# Altium project PCB_Project1.PrjPCB
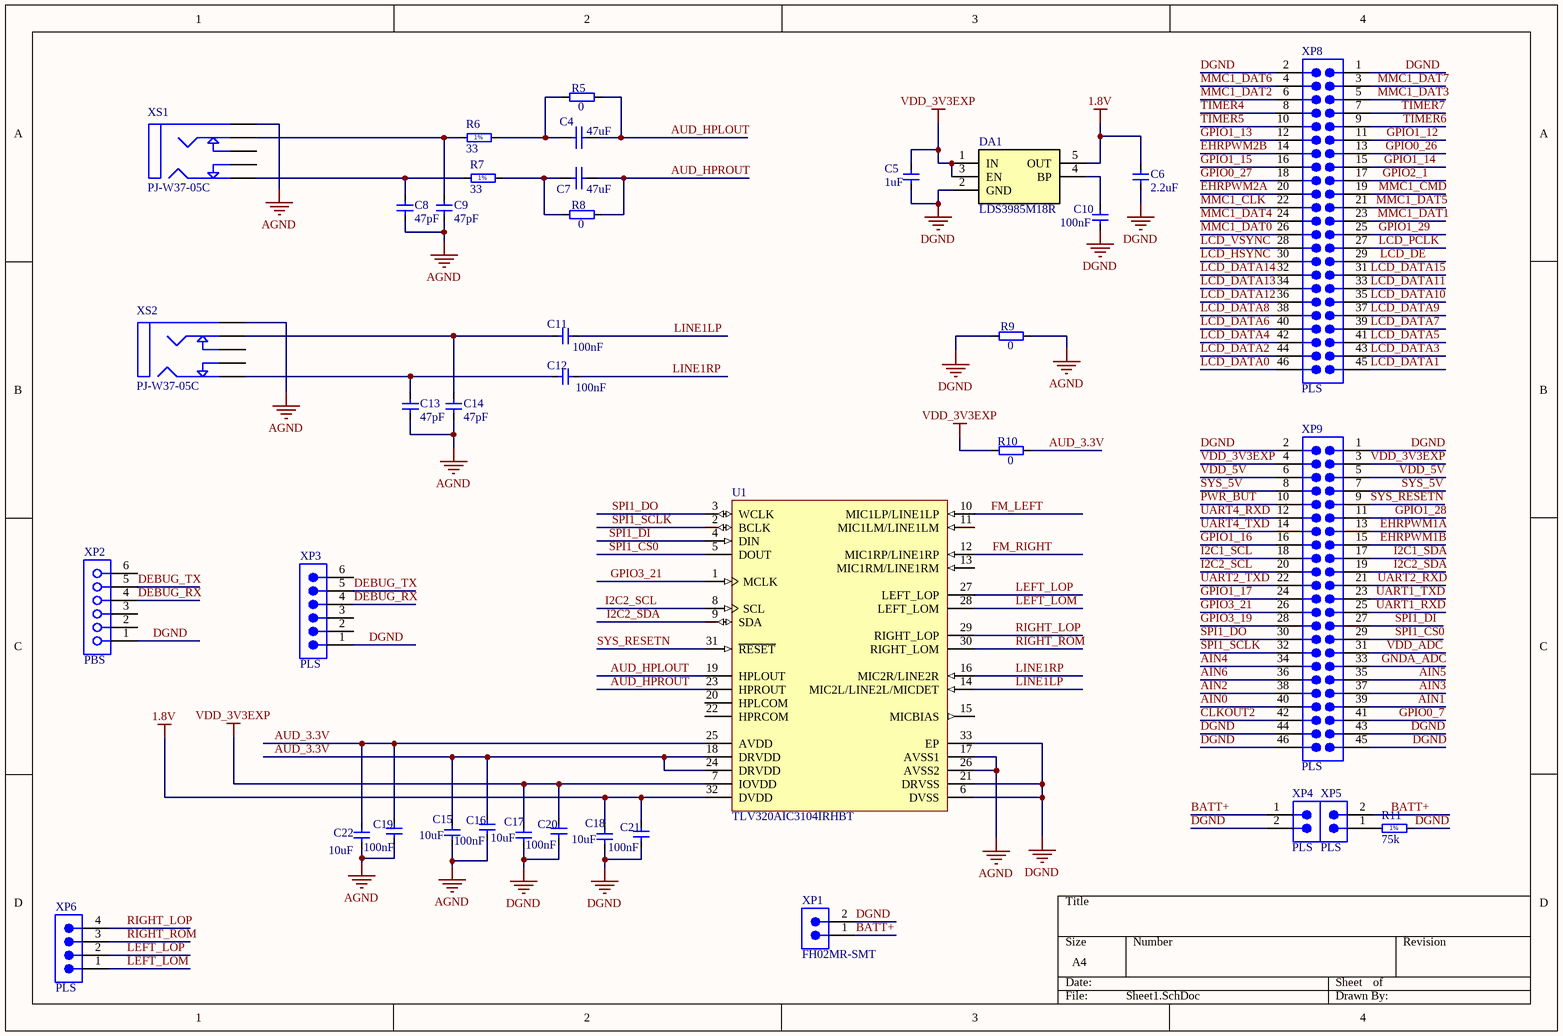
[diagram p0: Sheet1.SchDoc]
4 sheets, 98 parts. Net scope: global (net labels, ports and power ports of the same name join across sheets).
Board file: PCB1.PcbDoc
Sheets:
  Sheet1.SchDoc
  Sheet2.SchDoc
  GPS.SchDoc
  Radio.SchDoc

## Sheet Sheet1.SchDoc
size A4

### Parts
C4  47uF  [CAPC2012X140N]
C5  1uF  [CAP0603R]
C6  2.2uF  [CAP0603R]
C7  47uF  [CAPC2012X140N]
C8  47pF  [CAP0603R]
C9  47pF  [CAP0603R]
C10  100nF  [CAP0603R]
C11  100nF  [CAP0603R]
C12  100nF  [CAP0603R]
C13  47pF  [CAP0603R]
C14  47pF  [CAP0603R]
C15  10uF  [CAP0603R]
C16  100nF  [CAP0603R]
C17  10uF  [CAP0603R]
C18  10uF  [CAP0603R]
C19  100nF  [CAP0603R]
C20  100nF  [CAP0603R]
C21  100nF  [CAP0603R]
C22  10uF  [CAP0603R]
DA1  LDS3985M18R  [SOT23-5]
R5  0  [RESC1608X55N]
R6  33  [RES0603R]
R7  33  [RES0603R]
R8  0  [RESC1608X55N]
R9  0  [RESC1608X55N]
R10  0  [RESC1608X55N]
R11  75k  [RES0603R]
U1  TLV320AIC3104IRHBT  [RHB32-3450X3450TP]
XP1  FH02MR-SMT  [FH02MR-SMT]
XP2  PBS  [PBS-06]
XP3  PLS  [PLS-06]
XP4  PLS  [PLS-02]
XP5  PLS  [PLS-02]
XP6  PLS  [PLS-04]
XP8  PLS  [PLD-46]
XP9  PLS  [PLD-46]
XS1  PJ-W37-05C  [PJ-W37-05C]
XS2  PJ-W37-05C  [PJ-W37-05C]

### Nets
1.8V: C6.2 C18.2 C21.1 DA1.5(OUT) U1.32(DVDD)
AGND: C8.2 C9.2 C13.2 C14.2 C15.1 C16.2 C19.2 C22.1 R9.2 U1.17(AVSS1) U1.26(AVSS2) XS1.1 XS2.1
DGND: C5.2 C6.1 C10.1 C17.1 C18.1 C20.2 C21.2 DA1.2(GND) R9.1 R11.2 U1.6(DVSS) U1.21(DRVSS) U1.33(EP) XP1.2 XP2.1 XP3.1 XP4.2 XP8.1 XP8.2 XP9.1 XP9.2 XP9.43 XP9.44 XP9.45 XP9.46
VDD_3V3EXP: C5.1 C17.2 C20.1 DA1.1(IN) DA1.3(EN) R10.1 U1.7(IOVDD) XP9.3 XP9.4
AIN0: XP9.40
AIN1: XP9.39
AIN2: XP9.38
AIN3: XP9.37
AIN4: XP9.34
AIN5: XP9.35
AIN6: XP9.36
AUD_3.3V: C15.2 C16.1 C19.1 C22.2 R10.2 U1.18(DRVDD) U1.24(DRVDD) U1.25(AVDD)
AUD_HPLOUT: C4.2 R5.2 U1.19(HPLOUT)
AUD_HPROUT: C7.2 R8.2 U1.23(HPROUT)
BATT+: XP1.1 XP4.1 XP5.2
CLKOUT2: XP9.42
DEBUG_RX: XP2.4 XP3.4
DEBUG_TX: XP2.5 XP3.5
EHRPWM1A: XP9.13
EHRPWM1B: XP9.15
EHRPWM2A: XP8.20
EHRPWM2B: XP8.14
FM_LEFT: U1.10(MIC1LP/LINE1LP)
FM_RIGHT: U1.12(MIC1RP/LINE1RP)
GNDA_ADC: XP9.33
GPIO0_7: XP9.41
GPIO0_26: XP8.13
GPIO0_27: XP8.18
GPIO1_12: XP8.11
GPIO1_13: XP8.12
GPIO1_14: XP8.15
GPIO1_15: XP8.16
GPIO1_16: XP9.16
GPIO1_17: XP9.24
GPIO1_28: XP9.11
GPIO1_29: XP8.25
GPIO2_1: XP8.17
GPIO3_19: XP9.28
GPIO3_21: U1.1(MCLK) XP9.26
I2C1_SCL: XP9.18
I2C1_SDA: XP9.17
I2C2_SCL: U1.8(SCL) XP9.20
I2C2_SDA: U1.9(SDA) XP9.19
LCD_DATA0: XP8.46
LCD_DATA1: XP8.45
LCD_DATA2: XP8.44
LCD_DATA3: XP8.43
LCD_DATA4: XP8.42
LCD_DATA5: XP8.41
LCD_DATA6: XP8.40
LCD_DATA7: XP8.39
LCD_DATA8: XP8.38
LCD_DATA9: XP8.37
LCD_DATA10: XP8.35
LCD_DATA11: XP8.33
LCD_DATA12: XP8.36
LCD_DATA13: XP8.34
LCD_DATA14: XP8.32
LCD_DATA15: XP8.31
LCD_DE: XP8.29
LCD_HSYNC: XP8.30
LCD_PCLK: XP8.27
LCD_VSYNC: XP8.28
LEFT_LOM: U1.28(LEFT_LOM) XP6.1
LEFT_LOP: U1.27(LEFT_LOP) XP6.2
LINE1LP: C11.2 U1.14(MIC2L/LINE2L/MICDET)
LINE1RP: C12.2 U1.16(MIC2R/LINE2R)
MMC1_CLK: XP8.22
MMC1_CMD: XP8.19
MMC1_DAT0: XP8.26
MMC1_DAT1: XP8.23
MMC1_DAT2: XP8.6
MMC1_DAT3: XP8.5
MMC1_DAT4: XP8.24
MMC1_DAT5: XP8.21
MMC1_DAT6: XP8.4
MMC1_DAT7: XP8.3
PWR_BUT: XP9.10
RIGHT_LOP: U1.29(RIGHT_LOP) XP6.4
RIGHT_ROM: U1.30(RIGHT_LOM) XP6.3
SPI1_CS0: U1.5(DOUT) XP9.29
SPI1_DI: U1.4(DIN) XP9.27
SPI1_DO: U1.3(WCLK) XP9.30
SPI1_SCLK: U1.2(BCLK) XP9.32
SYS_5V: XP9.7 XP9.8
SYS_RESETN: U1.31(~{RESET}) XP9.9
TIMER4: XP8.8
TIMER5: XP8.10
TIMER6: XP8.9
TIMER7: XP8.7
UART1_RXD: XP9.25
UART1_TXD: XP9.23
UART2_RXD: XP9.21
UART2_TXD: XP9.22
UART4_RXD: XP9.12
UART4_TXD: XP9.14
VDD_5V: XP9.5 XP9.6
VDD_ADC: XP9.31
NetC4_1: C4.1 R5.1 R6.2
NetC7_1: C7.1 R7.2 R8.1
NetC8_1: C8.1 R7.1 XS1.3
NetC9_1: C9.1 R6.1 XS1.2
NetC10_2: C10.2 DA1.4(BP)
NetC11_1: C11.1 C14.1 XS2.2
NetC12_1: C12.1 C13.1 XS2.3
NetR11_1: R11.1 XP5.1

Not connected (* = marked no-connect by the designer): U1 11(MIC1LM/LINE1LM) 13(MIC1RM/LINE1RM) 15(MICBIAS) 20(HPLCOM) 22(HPRCOM); XP2 2 3 6; XP3 2 3 6; XS1 4 5; XS2 4 5

### Notes on the sheet
- (in symbol R0603_33R_1%_0.1W_100PPM) 1%
- (in symbol R0603_75K_1%_0.1W_100PPM) 1%

### Library data of the parts
C4 C7 = CC0805_47UF_6.3V_20%_X5R: Non-polarised capacitor; Part Description: SMD Multilayer Chip Ceramic Capacitor; Manufacturer: GENERIC; Manufacturer1 Part Number: C0805C476M9PACTU; Voltage: 6.3V; TC: X5R; Tolerance: ±20%; Table: Capacitors SMD; Part Number: CC0805_47UF_6.3V_20%_X5R; Component Kind: Standard; Component Type: Standard; Pin Count: 2; Value: 47uF; Status: Preferred; Manufacturer Part Number: CC0805_47UF_6.3V_20%_X5R; Case: 0805; Mounted: Yes; Socket: No; SMD: Yes; Manufacturer1 Example: KEMET; Manufacturer1 ComponentHeight: 1.4mm; HelpURL: \\cern.ch\dfs\Applications\Altium\Datasheets\CC0805_X5R_KEMET.pdf; Author: CERN DEM JLC; CreateDate: 16.10.2012; LatestRevisionDate: 16.10.2012
C5 = CC0603_1UF_16V_10%_X7R: SMD 0805 Capacitor; Part Description: SMD Multilayer Chip Ceramic Capacitor; Manufacturer: GENERIC; Manufacturer1 Part Number: 223824613663; Voltage: 16V; TC: X7R; Tolerance: ±10%; Table: Capacitors SMD; Part Number: CC0603_1UF_16V_10%_X7R; Component Kind: Standard; Component Type: Standard; Pin Count: 2; Value: 1uF; Status: Preferred; Manufacturer Part Number: CC0603_1uF_16V_10%_X7R; Case: 0603; Mounted: Yes; Socket: No; SMD: Yes; Manufacturer1 Example: PHYCOMP; Manufacturer1 ComponentHeight: 0.87mm; HelpURL: \\cern.ch\dfs\Applications\Altium\Datasheets\CC0805_X5R_PHYCOMP_HC.pdf; Author: I. Kuznetsov; CreateDate: 03.12.2007; LatestRevisionDate: 03.12.2007
C6 = CC0603_2.2UF_6.3V_10%_X5R: SMD 0805 Capacitor; Part Description: SMD Multilayer Chip Ceramic Capacitor; Manufacturer: GENERIC; Manufacturer1 Part Number: 225520613667; Voltage: 6.3V; TC: X5R; Tolerance: ±10%; Table: Capacitors SMD; Part Number: CC0603_2.2UF_6.3V_10%_X5R; Component Kind: Standard; Component Type: Standard; Pin Count: 2; Value: 2.2uF; Status: Preferred; Manufacturer Part Number: CC0603_2.2uF_6.3V_10%_X5R; Case: 0603; Mounted: Yes; Socket: No; SMD: Yes; Manufacturer1 Example: PHYCOMP; Manufacturer1 ComponentHeight: 0.87mm; HelpURL: \\cern.ch\dfs\Applications\Altium\Datasheets\CC0805_X5R_PHYCOMP_HC.pdf; Author: I. Kuznetsov; CreateDate: 03.12.2007; LatestRevisionDate: 03.12.2007
C8 C9 C13 C14 = CC0603_47PF_50V_5%_NP0: SMD 0805 Capacitor; Part Description: SMD Multilayer Chip Ceramic Capacitor; Manufacturer: GENERIC; Manufacturer1 Part Number: 223886715479; Voltage: 50V; TC: NP0; Tolerance: ±5%; Table: Capacitors SMD; Part Number: CC0603_47PF_50V_5%_NP0; Component Kind: Standard; Component Type: Standard; Pin Count: 2; Value: 47pF; Status: Preferred; Manufacturer Part Number: CC0603_47PF_50V_5%_NP0; Case: 0603; Mounted: Yes; Socket: No; SMD: Yes; Manufacturer1 Example: PHYCOMP; Manufacturer1 ComponentHeight: 0.87mm; HelpURL: \\cern.ch\dfs\Applications\Altium\Datasheets\CC0603_NP0_PHYCOMP.pdf; Author: I. Kuznetsov; CreateDate: 03.12.2007; LatestRevisionDate: 03.12.2007
C10-C12 C16 C19-C21 = CC0603_100NF_50V_10%_X7R: SMD 0805 Capacitor; Part Description: SMD Multilayer Chip Ceramic Capacitor; Manufacturer: GENERIC; Manufacturer1 Part Number: 223858615649; Voltage: 50V; TC: X7R; Tolerance: ±10%; Table: Capacitors SMD; Part Number: CC0603_100NF_50V_10%_X7R; Component Kind: Standard; Component Type: Standard; Pin Count: 2; Value: 100nF; Status: Preferred; Manufacturer Part Number: CC0603_100NF_50V_10%_X7R; Case: 0603; Mounted: Yes; Socket: No; SMD: Yes; Manufacturer1 Example: PHYCOMP; Manufacturer1 ComponentHeight: 0.87mm; HelpURL: \\cern.ch\dfs\Applications\Altium\Datasheets\CC0603_X7R_PHYCOMP.pdf; Author: I. Kuznetsov; CreateDate: 03.12.2007; LatestRevisionDate: 03.12.2007
C15 C17 C18 C22 = CC0603_10UF_6.3V_20%_X5R: SMD 0805 Capacitor; Part Description: SMD Multilayer Chip Ceramic Capacitor; Manufacturer: GENERIC; Manufacturer1 Part Number: C0603C106M9PAC; Voltage: 6.3V; TC: X5R; Tolerance: ±20%; Table: Capacitors SMD; Part Number: CC0603_10UF_6.3V_20%_X5R; Component Kind: Standard; Component Type: Standard; Pin Count: 2; Value: 10uF; Status: Preferred; Manufacturer Part Number: CC0603_10uF_6.3V_20%_X5R; Case: 0603; Mounted: Yes; Socket: No; SMD: Yes; Manufacturer1 Example: KEMET; Manufacturer1 ComponentHeight: 0.95mm; HelpURL: \\cern.ch\dfs\Applications\Altium\Datasheets\CC0603_X5R_KEMET.pdf; Author: I. Kuznetsov; CreateDate: 03.12.2007; LatestRevisionDate: 03.12.2007
DA1 = LDS3985M18R: Manufacturer: ST; Table: Regulators; Part Number: LDS3985M18R; Component Kind: Standard; Component Type: Standard; Device: LDS3985M18R; Status: Active; Manufacturer Part Number: LDS3985M18R; Pin Count: 5; Case: SOT23-5; Mounted: Yes; Socket: No; SMD: Yes; Author: I. Kuznetsov
R5 R8-R10 = R0603_0R_JUMPER: Resistor; Part Description: 1A (0.05R Max DC Resistance) Zero Ohm Jumper; Manufacturer: GENERIC; Manufacturer1 Part Number: NRC06Z0; Table: Resistors SMD; Part Number: R0603_0R_JUMPER; Component Kind: Standard; Component Type: Standard; Pin Count: 2; Value: 0; Status: Preferred; Manufacturer Part Number: R0603_0R_JUMPER; Case: 0603; Mounted: Yes; Socket: No; SMD: Yes; Manufacturer1 Example: NIC COMPONENT; Manufacturer1 ComponentHeight: 0.55mm; HelpURL: \\cern.ch\dfs\Applications\Altium\Datasheets\R0603_NIC_NRC.pdf; Author: CERN DEM JLC; CreateDate: 03.12.2007; LatestRevisionDate: 13.03.2008
R6 R7 = R0603_33R_1%_0.1W_100PPM: Part Description: General Purpose Thick Film Chip Resistor; Manufacturer: GENERIC; Manufacturer1 Part Number: NRC06F33R0TRF; Power: 0.1W; TC: ±100ppm/°C; Tolerance: ±1%; Table: Resistors SMD; Part Number: R0603_33R_1%_0.1W_100PPM; Component Kind: Standard; Component Type: Standard; Footprint: RESC1608X55N; Pin Count: 2; Value: 33; Status: Preferred; Manufacturer Part Number: R0603_33R_1%_0.1W_100PPM; Case: 0603; Mounted: Yes; Socket: No; SMD: Yes; Manufacturer1 Example: NIC COMPONENT; Manufacturer1 ComponentHeight: 0.55mm; HelpURL: \\cern.ch\dfs\Applications\Altium\Datasheets\R0603_NIC_NRC.pdf; Author: CERN DEM JLC; CreateDate: 03.12.2007; LatestRevisionDate: 13.03.2008
R11 = R0603_75K_1%_0.1W_100PPM: Part Description: General Purpose Thick Film Chip Resistor; Manufacturer: GENERIC; Manufacturer1 Part Number: NRC06F7502TRF; Power: 0.1W; TC: ±100ppm/°C; Tolerance: ±1%; Table: Resistors SMD; Part Number: R0603_75K_1%_0.1W_100PPM; Component Kind: Standard; Component Type: Standard; Footprint: RESC1608X55N; Pin Count: 2; Value: 75k; Status: Preferred; Manufacturer Part Number: R0603_75K_1%_0.1W_100PPM; Case: 0603; Mounted: Yes; Socket: No; SMD: Yes; Manufacturer1 Example: NIC COMPONENT; Manufacturer1 ComponentHeight: 0.55mm; HelpURL: \\cern.ch\dfs\Applications\Altium\Datasheets\R0603_NIC_NRC.pdf; Author: CERN DEM JLC; CreateDate: 03.12.2007; LatestRevisionDate: 13.03.2008
U1 = CMP-0331-00065-1: Low-Power Stereo CODEC with 6 Inputs, 6 Outputs, HP Amp and Enhanced Digital Effects, 2 ADCs and 2 DACs, 102 dB DAC SNR, -40 to 85 degC, 32-pin QFN (RHB), Green (RoHS & no Sb/Br); Manufacturer: Texas Instruments; Digital Audio Interfaces: L, R, I2S, DSP, TDM; Additional Features: LP Bypass, Notch Filtering, 3D, EQ, Matrix Mixing, PLL; Sampling Rate (Max) (kHz): 96; # ADCs (typ): 2; Battery Powered: TRUE; DAC SNR: 102; Control Interface: I2C; PartNumber: TLV320AIC3104IRHBT; Code_JEDEC: MO-220; ComponentLink1Description: Datasheet; Mounting Technology: Surface Mount; PackageVersion: revD, Jun-2011; DatasheetVersion: SLAS510C; PackageReference: RHB32-3450X3450TP; PackageDescription: 32-Pin Plastic Quad Flat No-Lead, 5 x 5 mm Body, 0.5 mm Pitch, 3.45 x 3.45 mm Exposed Pad; # DACs: 2; ComponentLink1URL: http://www.ti.com/general/docs/lit/getliterature.tsp?genericPartNumber=TLV320AIC3104&fileType=pdf
XP1 = FH02MR-SMT: Table: OTHER; Part Number: FH02MR-SMT; Family: FH02MR-SMT; Device: FH02MR-SMT
XP2 = PBS-06: Table: AUK; Part Number: PBS-06; Component Kind: Standard; Component Type: Standard; PackageDescription: PBS-06; Pin Count: 6; Family: PBS; SMD: No; Device: PBS-06
XP3 = PLS-06: Manufacturer: AUK; Part Number: PLS-06; Component Kind: Standard; Component Type: Standard; PackageDescription: PLS-06; Pin Count: 6; Family: PLS; SMD: Yes; Device: PLS-06; Manufacturer Part Number: PLS-06; Table: AUK
XP4 XP5 = PLS-02: Manufacturer: AUK; Part Number: PLS-02; Component Kind: Standard; Component Type: Standard; PackageDescription: PLS-02; Pin Count: 2; Family: PLS; SMD: No; Device: PLS-02; Manufacturer Part Number: PLS-02; Table: AUK
XP6 = PLS-04: Manufacturer: AUK; Part Number: PLS-04; Component Kind: Standard; Component Type: Standard; PackageDescription: PLS-04; Pin Count: 4; Family: PLS; SMD: No; Device: PLS-04; Manufacturer Part Number: PLS-04; Table: AUK
XP8 XP9 = PLD-46: Manufacturer: AUK; Manufacturer Part Number: PLS-16; Part Number: PLD-46; Component Kind: Standard; Component Type: Standard; PackageDescription: PLS-16; Pin Count: 16; Family: PLS; SMD: No; Device: PLD-46; Table: AUK
XS1 XS2 = PJ-W37-05C: 3.5 mm Jack Connector; Table: AUK; Part Number: PJ-W37-05C; Family: PJ; Device: PJ-W37-05C

## Sheet Sheet2.SchDoc
size A4
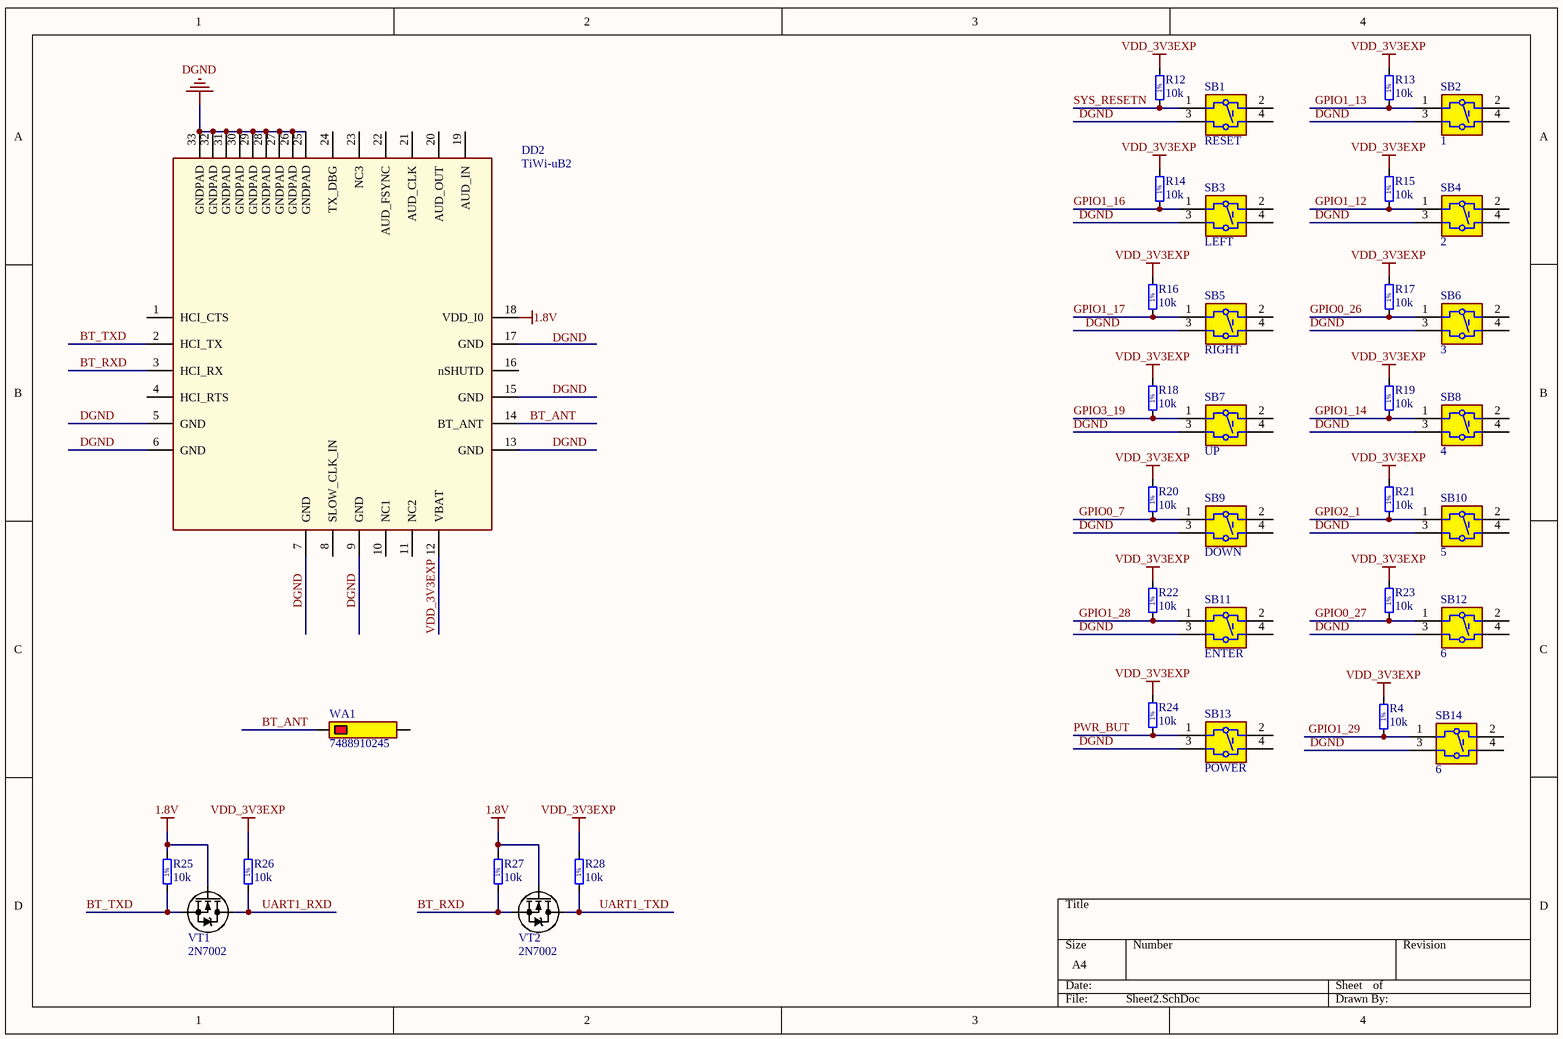
[diagram p1: Sheet2.SchDoc]

### Parts
DD2  TiWi-uB2  [TiWi-uB2]
R4  10k  [RES0603R]
R12  10k  [RES0603R]
R13  10k  [RES0603R]
R14  10k  [RES0603R]
R15  10k  [RES0603R]
R16  10k  [RES0603R]
R17  10k  [RES0603R]
R18  10k  [RES0603R]
R19  10k  [RES0603R]
R20  10k  [RES0603R]
R21  10k  [RES0603R]
R22  10k  [RES0603R]
R23  10k  [RES0603R]
R24  10k  [RES0603R]
R25  10k  [RES0603R]
R26  10k  [RES0603R]
R27  10k  [RES0603R]
R28  10k  [RES0603R]
SB1  RESET  [DTSMW-3.8N]
SB2  1  [DTSMW-3.8N]
SB3  LEFT  [DTSMW-3.8N]
SB4  2  [DTSMW-3.8N]
SB5  RIGHT  [DTSMW-3.8N]
SB6  3  [DTSMW-3.8N]
SB7  UP  [DTSMW-3.8N]
SB8  4  [DTSMW-3.8N]
SB9  DOWN  [DTSMW-3.8N]
SB10  5  [DTSMW-3.8N]
SB11  ENTER  [DTSMW-3.8N]
SB12  6  [DTSMW-3.8N]
SB13  POWER  [DTSMW-3.8N]
SB14  6  [DTSMW-3.8N]
VT1  2N7002  [SOT23]
VT2  2N7002  [SOT23]
WA1  7488910245  [7488910245]

### Nets
1.8V: DD2.18(VDD_I0) R25.2 R27.2 VT1.1(G) VT2.1(G)
DGND: DD2.5(GND) DD2.6(GND) DD2.7(GND) DD2.9(GND) DD2.13(GND) DD2.15(GND) DD2.25(GNDPAD) DD2.26(GNDPAD) DD2.27(GNDPAD) DD2.28(GNDPAD) DD2.29(GNDPAD) DD2.30(GNDPAD) DD2.31(GNDPAD) DD2.32(GNDPAD) DD2.33(GNDPAD) SB1.3(T3) SB2.3(T3) SB3.3(T3) SB4.3(T3) SB5.3(T3) SB6.3(T3) SB7.3(T3) SB8.3(T3) SB9.3(T3) SB10.3(T3) SB11.3(T3) SB12.3(T3) SB13.3(T3) SB14.3(T3)
VDD_3V3EXP: DD2.12(VBAT) R4.2 R12.2 R13.2 R14.2 R15.2 R16.2 R17.2 R18.2 R19.2 R20.2 R21.2 R22.2 R23.2 R24.2 R26.2 R28.2
BT_ANT: DD2.14(BT_ANT) WA1.1
BT_RXD: DD2.3(HCI_RX) R27.1 VT2.2(S)
BT_TXD: DD2.2(HCI_TX) R25.1 VT1.2(S)
GPIO0_7: R20.1 SB9.1(T1)
GPIO0_26: R17.1 SB6.1(T1)
GPIO0_27: R23.1 SB12.1(T1)
GPIO1_12: R15.1 SB4.1(T1)
GPIO1_13: R13.1 SB2.1(T1)
GPIO1_14: R19.1 SB8.1(T1)
GPIO1_16: R14.1 SB3.1(T1)
GPIO1_17: R16.1 SB5.1(T1)
GPIO1_28: R22.1 SB11.1(T1)
GPIO1_29: R4.1 SB14.1(T1)
GPIO2_1: R21.1 SB10.1(T1)
GPIO3_19: R18.1 SB7.1(T1)
PWR_BUT: R24.1 SB13.1(T1)
SYS_RESETN: R12.1 SB1.1(T1)
UART1_RXD: R26.1 VT1.3(D)
UART1_TXD: R28.1 VT2.3(D)

Not connected (* = marked no-connect by the designer): DD2 1(HCI_CTS) 4(HCI_RTS) 8(SLOW_CLK_IN) 10(NC1) 11(NC2) 16(nSHUTD) 17(GND) 19(AUD_IN) 20(AUD_OUT) 21(AUD_CLK) 22(AUD_FSYNC) 23(NC3) 24(TX_DBG); SB1 2(T2) 4(T3); SB2 2(T2) 4(T3); SB3 2(T2) 4(T3); SB4 2(T2) 4(T3); SB5 2(T2) 4(T3); SB6 2(T2) 4(T3); SB7 2(T2) 4(T3); SB8 2(T2) 4(T3); SB9 2(T2) 4(T3); SB10 2(T2) 4(T3); SB11 2(T2) 4(T3); SB12 2(T2) 4(T3); SB13 2(T2) 4(T3); SB14 2(T2) 4(T3); WA1 2

### Notes on the sheet
- Labels drawn without touching a wire or pin: DGND
- (in symbol R0603_10K_1%_0.1W_100PPM) 1%

### Library data of the parts
R4 R12-R28 = R0603_10K_1%_0.1W_100PPM: Part Description: General Purpose Thick Film Chip Resistor; Manufacturer: GENERIC; Manufacturer1 Part Number: NRC06F1002TRF; Power: 0.1W; TC: ±100ppm/°C; Tolerance: ±1%; Table: Resistors SMD; Part Number: R0603_10K_1%_0.1W_100PPM; Component Kind: Standard; Component Type: Standard; Footprint: RESC1608X55N; Pin Count: 2; Value: 10k; Status: Preferred; Manufacturer Part Number: R0603_10K_1%_0.1W_100PPM; Case: 0603; Mounted: Yes; Socket: No; SMD: Yes; Manufacturer1 Example: NIC COMPONENT; Manufacturer1 ComponentHeight: 0.55mm; HelpURL: \\cern.ch\dfs\Applications\Altium\Datasheets\R0603_NIC_NRC.pdf; Author: CERN DEM JLC; CreateDate: 03.12.2007; LatestRevisionDate: 13.03.2008
SB1-SB14 = DTSMW-3.8N: Table: Button; Part Number: DTSMW-3.8N; Device: DTSMW-3.8N
VT1 VT2 = 2N7002: N-Channel Enhancement Mode FET; Part Description: MOSFET N-канал 60В/0.4А(пост.ток)/2.0А(импульсн.), встроенный диод; Table: Transistors; Part Number: 2N7002; Component Kind: Standard; Component Type: Standard; Device: 2N7002; Status: Active; Case: SOT23; Mounted: Yes; Socket: No; SMD: Yes; Author: I. Kuznetsov
WA1 = 7488910245: Bluetooth Antenna; Part Description: SMD Antenne WE-MCA; Manufacturer: Wurth Elektronik; Table: Power; Part Number: 7488910245; Component Kind: Standard; Component Type: Standard; Device: 7488910245; Manufacturer Part Number: 7488910245; Pin Count: 2; Case: 7488910245; Socket: No; SMD: Yes; ComponentHeight: 3.68; Author: I. Kuznetsov

## Sheet GPS.SchDoc
size A4
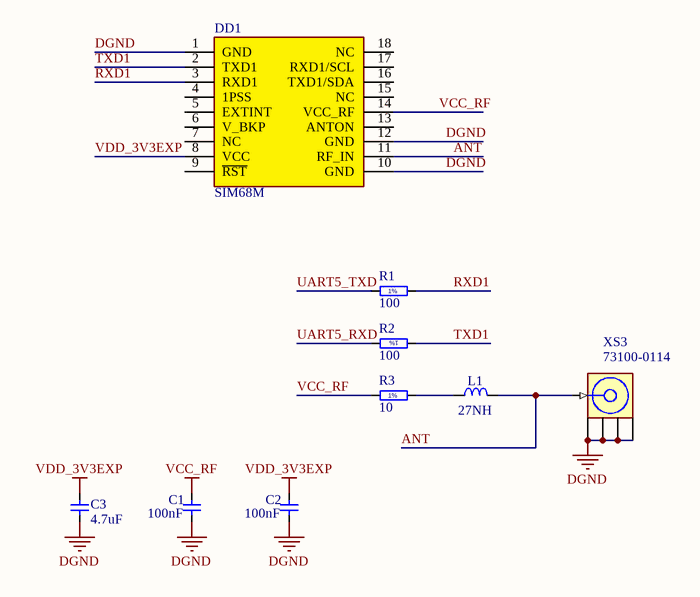
[diagram p2: GPS.SchDoc]

### Parts
C1  100nF  [CAP0603R]
C2  100nF  [CAP0603R]
C3  4.7uF  [CAP0603R]
DD1  SIM68M  [SIM68M]
L1  27NH  [INDC1608X75N]
R1  100  [RES0603R]
R2  100  [RES0603R]
R3  10  [RES0603R]
XS3  73100-0114  [73100-0114]

### Nets
DGND: C1.2 C2.2 C3.1 DD1.1(GND) DD1.10(GND) DD1.12(GND) XS3.2(GND) XS3.3(GND) XS3.4(GND) XS3.5(GND)
VCC_RF: C1.1 DD1.14(VCC_RF) R3.1
VDD_3V3EXP: C2.1 C3.2 DD1.8(VCC)
ANT: DD1.11(RF_IN) L1.2 XS3.1(Signal)
RXD1: DD1.3(RXD1) R1.2
TXD1: DD1.2(TXD1) R2.1
UART5_RXD: R2.2
UART5_TXD: R1.1
NetL1_1: L1.1 R3.2

Not connected (* = marked no-connect by the designer): DD1 4(1PSS) 5(EXTINT) 6(V_BKP) 7(NC) 9(~{RST}) 13(ANTON) 15(NC) 16(TXD1/SDA) 17(RXD1/SCL) 18(NC)

### Notes on the sheet
- (in symbol R0603_10R_1%_0.1W_200PPM) 1%
- (in symbol R0603_100R_1%_0.1W_100PPM) 1%

### Library data of the parts
C1 C2 = CC0603_100NF_50V_10%_X7R: as C10 on sheet Sheet1; Part Number: CC0603_100NF_50V_10%_X7R; Component Kind: Standard; Component Type: Standard; Pin Count: 2; Value: 100nF; Status: Preferred; Manufacturer Part Number: CC0603_100NF_50V_10%_X7R; Case: 0603; Mounted: Yes; Socket: No; SMD: Yes; Manufacturer1 Example: PHYCOMP; Manufacturer1 ComponentHeight: 0.87mm; HelpURL: \\cern.ch\dfs\Applications\Altium\Datasheets\CC0603_X7R_PHYCOMP.pdf; Author: I. Kuznetsov; CreateDate: 03.12.2007; LatestRevisionDate: 03.12.2007
C3 = CC0603_4.7UF_6.3V_10%_X5R: SMD 0805 Capacitor; Part Description: SMD Multilayer Chip Ceramic Capacitor; Manufacturer: GENERIC; Manufacturer1 Part Number: 225520613672; Voltage: 6.3V; TC: X5R; Tolerance: ±10%; Table: Capacitors SMD; Part Number: CC0603_4.7UF_6.3V_10%_X5R; Component Kind: Standard; Component Type: Standard; Pin Count: 2; Value: 4.7uF; Status: Preferred; Manufacturer Part Number: CC0603_4.7uF_6.3V_10%_X5R; Case: 0603; Mounted: Yes; Socket: No; SMD: Yes; Manufacturer1 Example: PHYCOMP; Manufacturer1 ComponentHeight: 0.87mm; HelpURL: \\cern.ch\dfs\Applications\Altium\Datasheets\CC0805_X5R_PHYCOMP_HC.pdf; Author: I. Kuznetsov; CreateDate: 03.12.2007; LatestRevisionDate: 03.12.2007
DD1 = SIM68M: Table: Analog and Interface; Part Number: SIM68M; Component Kind: Standard; Component Type: Standard; Device: SIM68M; PackageDescription: SIM68M; Status: Active; Manufacturer Part Number: SIM68M; Pin Count: 18; Case: SIM68M; Author: I. Kuznetsov
L1 = IND0603_TDK_MMZ1608B601C: Inductor; Part Description: SMT Chip Bead for Signal Line; Manufacturer: TDK; Value: 600R@100MHz; Power: 500mA; Resistance: 0.4R; Tolerance: ±25%; Table: Inductors SMD; Part Number: IND0603_TDK_MMZ1608B601C; Component Kind: Standard; Component Type: Standard; Pin Count: 2; Status: None; Manufacturer Part Number: MMZ1608B601C; Case: 0603; Mounted: Yes; Socket: No; SMD: Yes; ComponentHeight: 0.75mm; HelpURL: \\cern.ch\dfs\Applications\Altium\Datasheets\IND0603_TDK_MMZ1608.pdf; Author: CERN DEM JMW; CreateDate: 21.04.2009; LatestRevisionDate: 02.12.2009
R1 R2 = R0603_100R_1%_0.1W_100PPM: Part Description: General Purpose Thick Film Chip Resistor; Manufacturer: GENERIC; Manufacturer1 Part Number: NRC06F4700TRF; Power: 0.1W; TC: ±100ppm/°C; Tolerance: ±1%; Table: Resistors SMD; Part Number: R0603_100R_1%_0.1W_100PPM; Component Kind: Standard; Component Type: Standard; Footprint: RESC1608X55N; Pin Count: 2; Value: 100; Status: Preferred; Manufacturer Part Number: R0603_100R_1%_0.1W_100PPM; Case: 0603; Mounted: Yes; Socket: No; SMD: Yes; Manufacturer1 Example: NIC COMPONENT; Manufacturer1 ComponentHeight: 0.55mm; HelpURL: \\cern.ch\dfs\Applications\Altium\Datasheets\R0603_NIC_NRC.pdf; Author: CERN DEM JLC; CreateDate: 03.12.2007; LatestRevisionDate: 13.03.2008
R3 = R0603_10R_1%_0.1W_200PPM: Part Description: General Purpose Thick Film Chip Resistor; Manufacturer: GENERIC; Manufacturer1 Part Number: NRC06F10R0TRF; Power: 0.1W; TC: ±200ppm/°C; Tolerance: ±1%; Table: Resistors SMD; Part Number: R0603_10R_1%_0.1W_200PPM; Component Kind: Standard; Component Type: Standard; Footprint: RESC1608X55N; Pin Count: 2; Value: 10; Status: Preferred; Manufacturer Part Number: R0603_10R_1%_0.1W_200PPM; Case: 0603; Mounted: Yes; Socket: No; SMD: Yes; Manufacturer1 Example: NIC COMPONENT; Manufacturer1 ComponentHeight: 0.55mm; HelpURL: \\cern.ch\dfs\Applications\Altium\Datasheets\R0603_NIC_NRC.pdf; Author: CERN DEM JLC; CreateDate: 03.12.2007; LatestRevisionDate: 24.06.2009
XS3 = 73100-0114: RF Coaxial PCB Connector, MCX; Thru-Hole, Right-Angle Mount Socket, Blunt Post Terminal, 50 Ohm Impedance; Part Description: Connector; RF Coaxial, MCX, Thru-Hole; 5 Position; Right-Angle; Manufacturer: MOLEX; Part Number: 73100-0114; Component Kind: Standard; Component Type: Standard; PackageDescription: 73100-0114; Pin Count: 5; Family: SMA; Device: 73100-0114; Manufacturer Part Number: 73100-0114; ComponentLink1URL: http://www.molex.com/pdm_docs/sd/731000114_sd.pdf; Table: MOLEX

## Sheet Radio.SchDoc
size A4
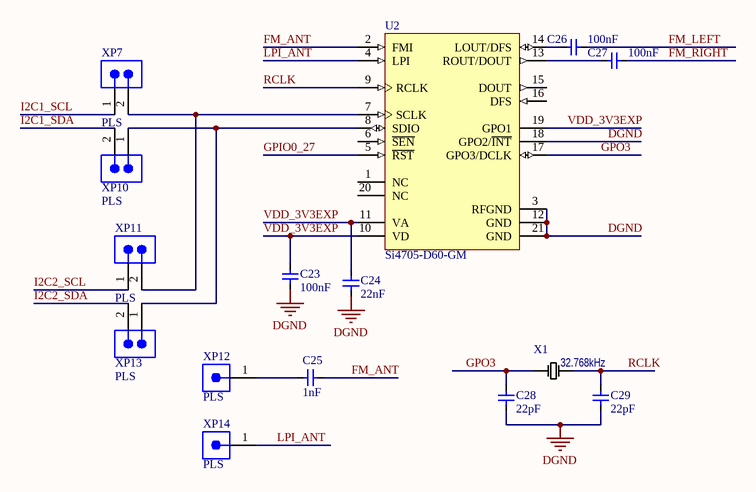
[diagram p3: Radio.SchDoc]

### Parts
C23  100nF  [CAP0603R]
C24  22nF  [CAP0603R]
C25  1nF  [CAP0603R]
C26  100nF  [CAP0603R]
C27  100nF  [CAP0603R]
C28  22pF  [CAP0603R]
C29  22pF  [CAP0603R]
U2  Si4705-D60-GM  [SLAB-QFN-20-1700x1700TP_V]
X1  32.768kHz  [5020]
XP7  PLS  [PLS-02]
XP10  PLS  [PLS-02]
XP11  PLS  [PLS-02]
XP12  PLS  [PLS-01]
XP13  PLS  [PLS-02]
XP14  PLS  [PLS-01]

### Nets
DGND: C23.1 C24.2 C28.1 C29.1 U2.3(RFGND) U2.12(GND) U2.18(GPO2/~{INT}) U2.21(GND)
VDD_3V3EXP: C23.2 C24.1 U2.10(VD) U2.11(VA) U2.19(GPO1)
FM_ANT: C25.2 U2.2(FMI)
FM_LEFT: C26.1
FM_RIGHT: C27.1
GPIO0_27: U2.5(~{RST})
GPO3: C28.2 U2.17(GPO3/DCLK) X1.1
I2C1_SCL: XP7.1
I2C1_SDA: XP10.2
I2C2_SCL: XP11.1
I2C2_SDA: XP13.2
LPI_ANT: U2.4(LPI) XP14.1
RCLK: C29.2 U2.9(RCLK) X1.2
NetC25_1: C25.1 XP12.1
NetC26_2: C26.2 U2.14(LOUT/DFS)
NetC27_2: C27.2 U2.13(ROUT/DOUT)
NetU2_7: U2.7(SCLK) XP7.2 XP11.2
NetU2_8: U2.8(SDIO) XP10.1 XP13.1

Not connected (* = marked no-connect by the designer): U2 1(NC) 6(~{SEN}) 15(DOUT) 16(DFS) 20(NC)

### Library data of the parts
C23 C26 C27 = CC0603_100NF_50V_10%_X7R: as C10 on sheet Sheet1; Part Number: CC0603_100NF_50V_10%_X7R; Component Kind: Standard; Component Type: Standard; Pin Count: 2; Value: 100nF; Status: Preferred; Manufacturer Part Number: CC0603_100NF_50V_10%_X7R; Case: 0603; Mounted: Yes; Socket: No; SMD: Yes; Manufacturer1 Example: PHYCOMP; Manufacturer1 ComponentHeight: 0.87mm; HelpURL: \\cern.ch\dfs\Applications\Altium\Datasheets\CC0603_X7R_PHYCOMP.pdf; Author: I. Kuznetsov; CreateDate: 03.12.2007; LatestRevisionDate: 03.12.2007
C24 = CC0603_22NF_50V_10%_X7R: SMD 0805 Capacitor; Part Description: SMD Multilayer Chip Ceramic Capacitor; Manufacturer: GENERIC; Manufacturer1 Part Number: 223858615641; Voltage: 50V; TC: X7R; Tolerance: ±10%; Table: Capacitors SMD; Part Number: CC0603_22NF_50V_10%_X7R; Component Kind: Standard; Component Type: Standard; Pin Count: 2; Value: 22nF; Status: Preferred; Manufacturer Part Number: CC0603_22NF_50V_10%_X7R; Case: 0603; Mounted: Yes; Socket: No; SMD: Yes; Manufacturer1 Example: PHYCOMP; Manufacturer1 ComponentHeight: 0.87mm; HelpURL: \\cern.ch\dfs\Applications\Altium\Datasheets\CC0603_X7R_PHYCOMP.pdf; Author: I. Kuznetsov; CreateDate: 03.12.2007; LatestRevisionDate: 03.12.2007
C25 = CC0603_1NF_50V_10%_X7R: SMD 0805 Capacitor; Part Description: SMD Multilayer Chip Ceramic Capacitor; Manufacturer: GENERIC; Manufacturer1 Part Number: 223858615623; Voltage: 50V; TC: X7R; Tolerance: ±10%; Table: Capacitors SMD; Part Number: CC0603_1NF_50V_10%_X7R; Component Kind: Standard; Component Type: Standard; Pin Count: 2; Value: 1nF; Status: Preferred; Manufacturer Part Number: CC0603_1NF_50V_10%_X7R; Case: 0603; Mounted: Yes; Socket: No; SMD: Yes; Manufacturer1 Example: PHYCOMP; Manufacturer1 ComponentHeight: 0.87mm; HelpURL: \\cern.ch\dfs\Applications\Altium\Datasheets\CC0603_X7R_PHYCOMP.pdf; Author: I. Kuznetsov; CreateDate: 03.12.2007; LatestRevisionDate: 03.12.2007
C28 C29 = CC0603_22PF_50V_5%_NP0: SMD 0805 Capacitor; Part Description: SMD Multilayer Chip Ceramic Capacitor; Manufacturer: GENERIC; Manufacturer1 Part Number: 223886715229; Voltage: 50V; TC: NP0; Tolerance: ±5%; Table: Capacitors SMD; Part Number: CC0603_22PF_50V_5%_NP0; Component Kind: Standard; Component Type: Standard; Pin Count: 2; Value: 22pF; Status: Preferred; Manufacturer Part Number: CC0603_22PF_50V_5%_NP0; Case: 0603; Mounted: Yes; Socket: No; SMD: Yes; Manufacturer1 Example: PHYCOMP; Manufacturer1 ComponentHeight: 0.87mm; HelpURL: \\cern.ch\dfs\Applications\Altium\Datasheets\CC0603_NP0_PHYCOMP.pdf; Author: I. Kuznetsov; CreateDate: 03.12.2007; LatestRevisionDate: 03.12.2007
U2 = CMP-0501-00017-1: Broadcast FM Radio Receiver with RDS / RBDS, -20 to 85 degC, 20-pin QFN, Tray; Manufacturer: Silicon Labs; RDS Support: TRUE; Sub-Family: FM Receivers; ComponentLink2Description: Datasheet; ComponentLink3Description: Package Specification; DatasheetVersion: Rev. 1.2; ComponentLink1URL: http://www.silabs.com/; Code_IPC: J-STD-020; Mounting Technology: Surface Mount; ComponentLink2URL: http://www.silabs.com/Support%20Documents/TechnicalDocs/Si4704-05-D60.pdf; ComponentLink1Description: Manufacturer URL; Packing: Tray; ComponentLink3URL: http://www.silabs.com/Support%20Documents/TechnicalDocs/C8051F99x.pdf; PackageDescription: 20-Pin Quad-Flat No-Leads Package, Body 3 x 3 mm, Pitch 0.5 mm; PartNumber: Si4705-D60-GM; PackageReference: QFN-20
X1 = CC4V-T1A: Кварцевый резонатор; Table: Crystall; Part Number: CC4V-T1A; Device: CC4V-T1A; PackageDescription: 5.0 x 2.0 x 1.3mm Crystal; Value: 32.768kHz; Author: I. Kuznetsov
XP7 XP10 XP11 XP13 = PLS-02: Manufacturer: AUK; Part Number: PLS-02; Component Kind: Standard; Component Type: Standard; PackageDescription: PLS-02; Pin Count: 2; Family: PLS; SMD: No; Device: PLS-02; Manufacturer Part Number: PLS-02; Table: AUK
XP12 XP14 = PLS-01: Manufacturer: AUK; Part Number: PLS-01; Component Kind: Standard; Component Type: Standard; PackageDescription: PLS-01; Pin Count: 1; Family: PLS; SMD: Yes; Device: PLS-01; Manufacturer Part Number: PLS-01; Table: AUK

## Nets that join several sheets
1.8V: Sheet1 (5 pins), Sheet2 (5 pins)
DGND: Sheet1 (25 pins), Sheet2 (29 pins), GPS (10 pins), Radio (8 pins)
VDD_3V3EXP: Sheet1 (9 pins), Sheet2 (17 pins), GPS (C2.1 C3.2 DD1.8), Radio (5 pins)
FM_LEFT: Sheet1 (U1.10), Radio (C26.1)
FM_RIGHT: Sheet1 (U1.12), Radio (C27.1)
GPIO0_7: Sheet1 (XP9.41), Sheet2 (R20.1 SB9.1)
GPIO0_26: Sheet1 (XP8.13), Sheet2 (R17.1 SB6.1)
GPIO0_27: Sheet1 (XP8.18), Sheet2 (R23.1 SB12.1), Radio (U2.5)
GPIO1_12: Sheet1 (XP8.11), Sheet2 (R15.1 SB4.1)
GPIO1_13: Sheet1 (XP8.12), Sheet2 (R13.1 SB2.1)
GPIO1_14: Sheet1 (XP8.15), Sheet2 (R19.1 SB8.1)
GPIO1_16: Sheet1 (XP9.16), Sheet2 (R14.1 SB3.1)
GPIO1_17: Sheet1 (XP9.24), Sheet2 (R16.1 SB5.1)
GPIO1_28: Sheet1 (XP9.11), Sheet2 (R22.1 SB11.1)
GPIO1_29: Sheet1 (XP8.25), Sheet2 (R4.1 SB14.1)
GPIO2_1: Sheet1 (XP8.17), Sheet2 (R21.1 SB10.1)
GPIO3_19: Sheet1 (XP9.28), Sheet2 (R18.1 SB7.1)
I2C1_SCL: Sheet1 (XP9.18), Radio (XP7.1)
I2C1_SDA: Sheet1 (XP9.17), Radio (XP10.2)
I2C2_SCL: Sheet1 (U1.8 XP9.20), Radio (XP11.1)
I2C2_SDA: Sheet1 (U1.9 XP9.19), Radio (XP13.2)
PWR_BUT: Sheet1 (XP9.10), Sheet2 (R24.1 SB13.1)
SYS_RESETN: Sheet1 (U1.31 XP9.9), Sheet2 (R12.1 SB1.1)
UART1_RXD: Sheet1 (XP9.25), Sheet2 (R26.1 VT1.3)
UART1_TXD: Sheet1 (XP9.23), Sheet2 (R28.1 VT2.3)